# Altium schematic sheet Micro_Essentials.SchDoc
size A4; SheetNumber: 3; SheetTotal: 8
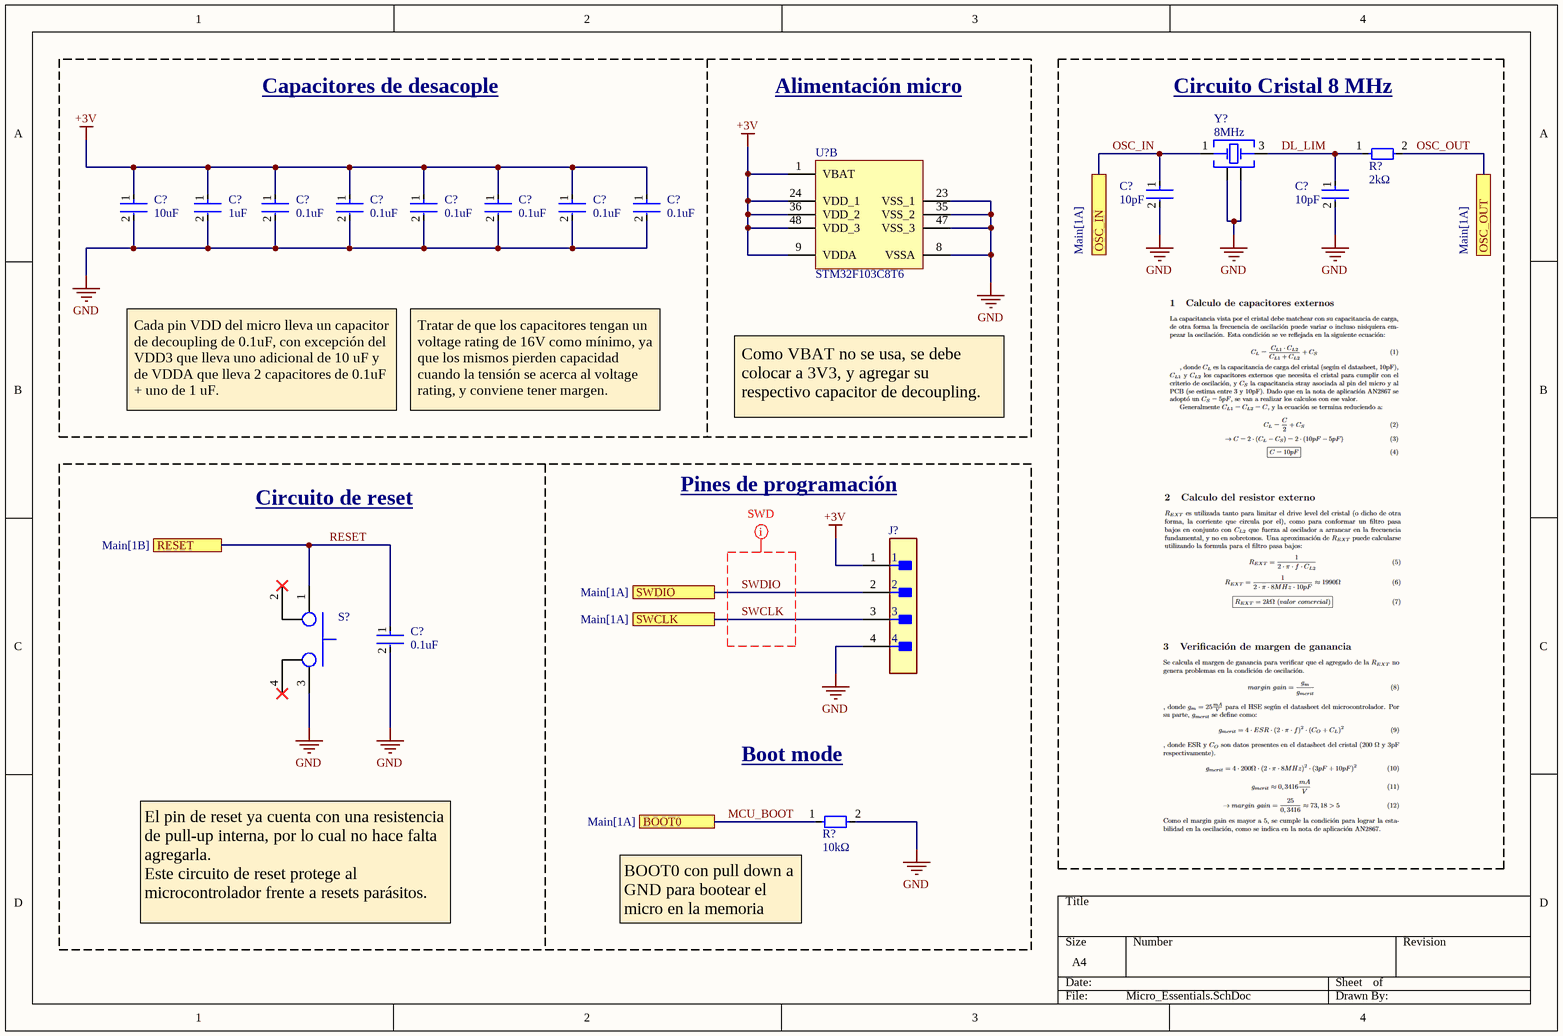
[diagram p0: Micro_Essentials.SchDoc]

## Parts
(Parts that share a designator on the sheet are numbered #1, #2 ... from top to bottom, then left to right.)
C?#1  Capacitance: 10pF  [FP-CL21-IPC_C]
C?#2  Capacitance: 10pF  [FP-CL21-IPC_C]
C?#3  Capacitance: 10uF  [FP-CL21-IPC_B]  (hidden comment: CL21A106KPFNNNE)
C?#4  Capacitance: 1uF  [FP-CL21-IPC_C]  (hidden comment: CL21B105KAFNNNG)
C?#5  Capacitance: 0.1uF  [FP-CL21-IPC_C]
C?#6  Capacitance: 0.1uF  [FP-CL21-IPC_C]
C?#7  Capacitance: 0.1uF  [FP-CL21-IPC_C]
C?#8  Capacitance: 0.1uF  [FP-CL21-IPC_C]
C?#9  Capacitance: 0.1uF  [FP-CL21-IPC_C]
C?#10  Capacitance: 0.1uF  [FP-CL21-IPC_C]
C?#11  Capacitance: 0.1uF  [FP-CL21-IPC_C]
J?  HTSW-104-07-G-S  [FP-HTSW-104-07-G-S-MFG]  (value not drawn)
R?#1  value 2kΩ  [PACKAGE_0805]  (hidden comment: Simbolo de resistencia genérica)
R?#2  value 10kΩ  [PACKAGE_0805]  (hidden comment: Simbolo de resistencia genérica)
S?  Tactile push button  [FP-B3W-1000-MFG]  (value not drawn)
U?  STM32F103C8T6  [STM-LQFP48_L]  (part B of 2)
Y?  Frequency: 8MHz  [WE-XTAL_12SMX]  (hidden comment: 830059082)

## Blocks framed on the sheet
Circuito Cristal 8 MHz: C?#1 C?#2 R?#1 Y?

## Ports
BOOT0 (see Main[1A]), OSC_IN (see Main[1A]), OSC_OUT (see Main[1A]), RESET (see Main[1B]), SWCLK (see Main[1A]), SWDIO (see Main[1A])

## Nets
+3V: C?#3.1 C?#4.1 C?#5.1 C?#6.1 C?#7.1 C?#8.1 C?#9.1 C?#10.1 J?.1 U?.1(VBAT) U?.9(VDDA) U?.24(VDD_1) U?.36(VDD_2) U?.48(VDD_3)
GND: C?#1.2 C?#2.2 C?#3.2 C?#4.2 C?#5.2 C?#6.2 C?#7.2 C?#8.2 C?#9.2 C?#10.2 C?#11.2 J?.4 R?#2.2 S?.3 U?.8(VSSA) U?.23(VSS_1) U?.35(VSS_2) U?.47(VSS_3) Y?.2(GND_&_Lid) Y?.4(GND_&_Lid)
DL_LIM: C?#2.1 R?#1.1 Y?.3(Crystal)
MCU_BOOT: R?#2.1 ; port BOOT0
OSC_IN: C?#1.1 Y?.1(Crystal) ; port OSC_IN
OSC_OUT: R?#1.2 ; port OSC_OUT
RESET: C?#11.1 S?.1 ; port RESET
SWCLK: J?.3 ; port SWCLK
SWDIO: J?.2 ; port SWDIO

Not connected (* = marked no-connect by the designer): S? 2* 4*

## Layout directives
net class SWD: SWCLK, SWDIO

## Notes on the sheet
- Capacitores de desacople
- Alimentación micro
- Cada pin VDD del micro lleva un capacitor de decoupling de 0.1uF, con excepción del VDD3 que lleva uno adicional de 10 uF y de VDDA que lleva 2 capacitores de 0.1uF + uno de 1 uF.
- Tratar de que los capacitores tengan un voltage rating de 16V como mínimo, ya que los mismos pierden capacidad cuando la tensión se acerca al voltage rating, y conviene tener margen.
- Como VBAT no se usa, se debe colocar a 3V3, y agregar su respectivo capacitor de decoupling.
- Circuito de reset
- Pines de programación
- Boot mode
- El pin de reset ya cuenta con una resistencia de pull-up interna, por lo cual no hace falta agregarla.
  Este circuito de reset protege al microcontrolador frente a resets parásitos.
- (near R?#2) BOOT0 con pull down a GND para bootear el micro en la memoria flash principal.

## Library data of the parts
C?#1 C?#2 C?#5-C?#11 = CMP-13271-003813-1: 0805 0.1uF 25V ±10% Tolerance X7R Multilayer Ceramic Chip Capacitor; Case Code (Imperial): 0805; Length: 2mm; Max Operating Temperature: 125°C; Tolerance: 10%; Depth: 1.25mm; Package Quantity: 3000; Material: Ceramic; Voltage Rating: 25V; Height: 1.25mm; Mount: Surface Mount; Dielectric: X7R; Packaging: Tape and Reel; Voltage: 25V; Case/Package: 0805; Radiation Hardening: No; Thickness: 0.053inch; Width: 0.049inch; Min Operating Temperature: -55°C; Case Code (Metric): 2012
C?#3 = CMP-2000-06103-2: CL21 Series 0805 10uF 10V ±10% Tolerance X5R Multilayer Ceramic Chip Capacitor; Case Code (Imperial): 0805; Mount: Surface Mount; Depth: 1.25mm; Length: 2mm; Lead Free: Lead Free; Packaging: Tape and Reel; Dielectric: X5R; Width: 0.049inch; Package Quantity: 1; Height: 1.25mm; Case/Package: 0805; Voltage Rating: 10V; Thickness: 0.053inch; Max Operating Temperature: 85°C; Tolerance: 10%; Case Code (Metric): 2012; Contact Plating: Tin; Min Operating Temperature: -55°C; Radiation Hardening: No; Voltage Rating (DC): 10V
C?#4 = CMP-13271-003813-1: CL21 Series 0805 1uF 25V ±10% Tolerance X7R Multilayer Ceramic Chip Capacitor; Case Code (Imperial): 0805; Length: 2mm; Max Operating Temperature: 125°C; Tolerance: 10%; Depth: 1.25mm; Package Quantity: 3000; Material: Ceramic; Voltage Rating: 25V; Height: 1.25mm; Mount: Surface Mount; Dielectric: X7R; Packaging: Tape and Reel; Voltage: 25V; Case/Package: 0805; Radiation Hardening: No; Thickness: 0.053inch; Width: 0.049inch; Min Operating Temperature: -55°C; Case Code (Metric): 2012
J? = CMP-02766-001776-1: CONN HEADER VERT 4POS 2.54MM; Gender: Male; Number of Contacts: 4; Packaging: Bulk; RoHS Compliant: Yes; Number of Rows: 1; Mount: Through Hole; Contact Material: Bronze; Series: HTSW; Radiation Hardening: No; Pitch: 2.54mm; Reach SVHC Compliant: Yes; Contact Plating: Gold; Termination: Through Hole
R?#1 R?#2 = Generic R
U? = CMP-0237-00215-3: ARM Cortex-M3 32-bit MCU, 64 KB Flash, 20 KB Internal RAM, 37 I/Os, 48-pin LQFP, -40 to 85 degC, Tray; Supply Voltage(Vcc) min (V): 2; Internal RAM Size (kB): 20; FLASH Size (Prog) (kB): 64; A/D Converter: 2x12-bit (10 Channel); I/Os (High Current): 37; Operating Frequency(F) (Processor speed) (MHz): 72; Core: ARM Cortex-M3; ComponentLink3Description: Package Specification; Mounting Technology: Surface Mount; PartNumber: STM32F103C8T6; PackageReference: LQFP48; Packing: Tray; ComponentLink3URL: http://www.st.com/st-web-ui/static/active/en/resource/technical/document/datasheet/DM00058181.pdf; DatasheetVersion: Rev. 16; ComponentLink1URL: http://www.st.com/web/en/home.html; PackageVersion: Rev. 6, 06/2013; ComponentLink2URL: http://www.st.com/st-web-ui/static/active/en/resource/technical/document/datasheet/CD00161566.pdf; ComponentLink1Description: Manufacturer URL; ComponentLink2Description: Datasheet; PackageDescription: 48-Pin Low Profile Quad Flat Package, 7 x 7 mm Body, 0.5 mm Pitch
Y? = CMP-03913-116855696-1: 830059082 WE-XTAL Quartz Crystal; Length: 7mm; Min Operating Temperature: -20°C; NexarPartId: 116855696; Max Operating Temperature: 70°C; Width: 5mm; Height: 1.4mm